# Altium schematic sheet trafo.SchDoc
size A4
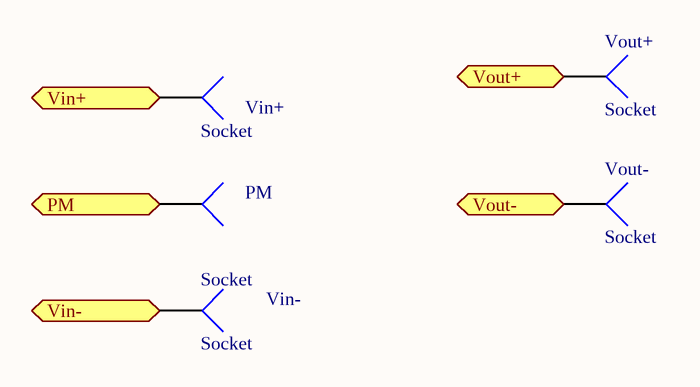
[diagram p0: trafo.SchDoc]

## Parts
PM  Socket  [PIN1]
Vin+  Socket  [PIN1]
Vin-  Socket  [PIN1]
Vout+  Socket  [PIN1]
Vout-  Socket  [PIN1]

## Ports
PM (in), Vin+ (in), Vin- (in), Vout+ (out), Vout- (out)

## Nets
PM: PM.1 ; port PM
Vin+: Vin+.1 ; port Vin+
Vin-: Vin-.1 ; port Vin-
Vout+: Vout+.1 ; port Vout+
Vout-: Vout-.1 ; port Vout-

## Library data of the parts
PM Vin+ Vin- Vout+ Vout- = Socket: LatestRevisionDate: 17-Jul-2002; LatestRevisionNote: Re-released for DXP Platform.; Publisher: Altium Limited